# Altium schematic sheet Indicators.SchDoc: Title
size A4; Project: Q24 VCU; ENG_APP_DATE: --/--/--; DSN_APP_DATE: --/--/--; CHK_APP_DATE: --/--/--; Date: *******; ApprovedBy: *******; CheckedBy: None; Author: *******; CompanyName: *******; DrawnBy: Jacob Chisholm; Engineer: *******; Organization: *******; Address1: *******; Address2: *******; Address3: *******; Address4: *******; DocumentNumber: 12; Revision: *******; SheetNumber: 12; SheetTotal: 14; Address_Website: https://jchisholm204.github.io; E-Mail: JacobChisholm1010@gmail.com; CurrentTime: *******; CurrentDate: *******; Time: *******; DocumentFullPathAndName: *******; DocumentName: *******; ModifiedDate: *******; ImagePath: *******; ProjectName: *******; Application_BuildNumber: *******
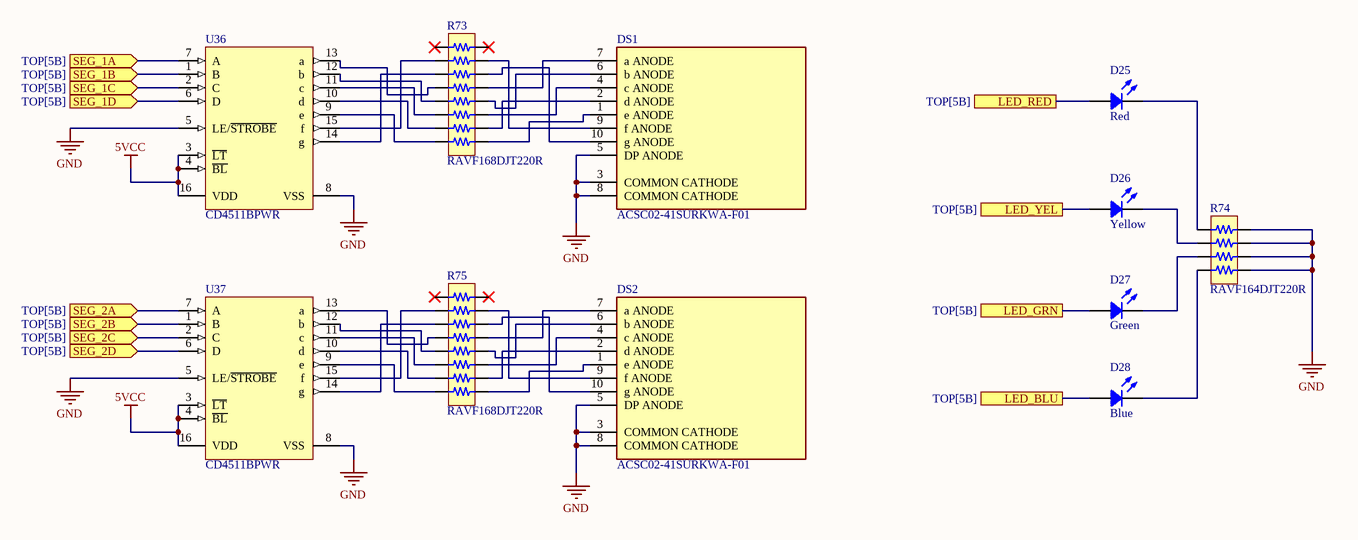
[diagram p0: Indicators.SchDoc]

## Parts
D25  Red  [LED 0805_2012 RED]
D26  Yellow  [LED 0805_2012 YELLOW]
D27  Green  [LED 0805_2012 GREEN]
D28  Blue  [LED 0805_2012 BLUE]
DS1  ACSC02-41SURKWA-F01  [FP-ACSC02-41SURKWA-F01-MFG]
DS2  ACSC02-41SURKWA-F01  [FP-ACSC02-41SURKWA-F01-MFG]
R73  RAVF168DJT220R  [RESNET 1506-16 CONVEX]
R74  RAVF164DJT220R  [RESNET 1206-8 CONVEX]
R75  RAVF168DJT220R  [RESNET 1506-16 CONVEX]
U36  CD4511BPWR  [PW0016A_N]
U37  CD4511BPWR  [PW0016A_N]

## Ports
LED_BLU (see TOP[5B]), LED_GRN (see TOP[5B]), LED_RED (see TOP[5B]), LED_YEL (see TOP[5B]), SEG_1A (in, see TOP[5B]), SEG_1B (in, see TOP[5B]), SEG_1C (in, see TOP[5B]), SEG_1D (in, see TOP[5B]), SEG_2A (in, see TOP[5B]), SEG_2B (in, see TOP[5B]), SEG_2C (in, see TOP[5B]), SEG_2D (in, see TOP[5B])

## Nets
5VCC: U36.3(~{LT}) U36.4(~{BL}) U36.16(VDD) U37.3(~{LT}) U37.4(~{BL}) U37.16(VDD)
GND: DS1.3(COMMON_CATHODE) DS1.5(DP_ANODE) DS1.8(COMMON_CATHODE) DS2.3(COMMON_CATHODE) DS2.5(DP_ANODE) DS2.8(COMMON_CATHODE) R74.5 R74.6 R74.7 R74.8 U36.5(LE/~{STROBE}) U36.8(VSS) U37.5(LE/~{STROBE}) U37.8(VSS)
LED_BLU: D28.1 ; port LED_BLU
LED_GRN: D27.1 ; port LED_GRN
LED_RED: D25.1 ; port LED_RED
LED_YEL: D26.1 ; port LED_YEL
SEG_1A: U36.7(A) ; port SEG_1A
SEG_1B: U36.1(B) ; port SEG_1B
SEG_1C: U36.2(C) ; port SEG_1C
SEG_1D: U36.6(D) ; port SEG_1D
SEG_2A: U37.7(A) ; port SEG_2A
SEG_2B: U37.1(B) ; port SEG_2B
SEG_2C: U37.2(C) ; port SEG_2C
SEG_2D: U37.6(D) ; port SEG_2D
NetD25_2: D25.2 R74.1
NetD26_2: D26.2 R74.2
NetD27_2: D27.2 R74.3
NetD28_2: D28.2 R74.4
NetDS1_1: DS1.1(e_ANODE) R73.9
NetDS1_2: DS1.2(d_ANODE) R73.10
NetDS1_4: DS1.4(c_ANODE) R73.11
NetDS1_6: DS1.6(b_ANODE) R73.12
NetDS1_7: DS1.7(a_ANODE) R73.13
NetDS1_9: DS1.9(f_ANODE) R73.15
NetDS1_10: DS1.10(g_ANODE) R73.14
NetDS2_1: DS2.1(e_ANODE) R75.9
NetDS2_2: DS2.2(d_ANODE) R75.10
NetDS2_4: DS2.4(c_ANODE) R75.11
NetDS2_6: DS2.6(b_ANODE) R75.12
NetDS2_7: DS2.7(a_ANODE) R75.13
NetDS2_9: DS2.9(f_ANODE) R75.15
NetDS2_10: DS2.10(g_ANODE) R75.14
NetR73_2: R73.2 U36.15(f)
NetR73_3: R73.3 U36.14(g)
NetR73_4: R73.4 U36.13(a)
NetR73_5: R73.5 U36.12(b)
NetR73_6: R73.6 U36.11(c)
NetR73_7: R73.7 U36.10(d)
NetR73_8: R73.8 U36.9(e)
NetR75_2: R75.2 U37.15(f)
NetR75_3: R75.3 U37.14(g)
NetR75_4: R75.4 U37.13(a)
NetR75_5: R75.5 U37.12(b)
NetR75_6: R75.6 U37.11(c)
NetR75_7: R75.7 U37.10(d)
NetR75_8: R75.8 U37.9(e)

Not connected (* = marked no-connect by the designer): R73 1* 16*; R75 1* 16*

## Notes on the sheet
- Title:
- Drawn By:
- Page Contents:
- Checked By:
- Size:
- Date:
- File:
- License:
- Email:
- A4
- Number:
- Time:
- Revision:
- Sheet
- Website:
- of

## Library data of the parts
D25 = SM0805URC: LED RED CLEAR 0805 SMD; Manufacturer: Bivar Inc.; Configuration: Standard; Current - Test: 20mA; Lens Color: Colorless; Lens Size: 1.40mm x 1.20mm; Lens Style: Rectangle with Flat Top; Millicandela Rating: 55mcd; Viewing Angle: 130°; Voltage - Forward (Vf) (Typ): 2.1V; Wavelength - Dominant: 640nm; Wavelength - Peak: 655nm; Part Number: SM0805URC; Color: Red; ComponentLink1Description: Datasheet; ComponentLink1URL: https://www.bivar.com/Files/Datasheets/SM0805URC.pdf; ComponentLink2Description: DigiKey Link; ComponentLink2URL: https://www.digikey.com/en/products/detail/bivar-inc/SM0805URC/528906; Device Package: 0805 (2012 Metric); Height (Max): 1.10mm; LastUpdated: 1/17/2024 9:33:19 PM; Lens Transparency: Clear; Lifecycle Status: Active; Minimum Order: 1; Mounting Type: Surface Mount; Package / Case: 0805 (2012 Metric); Packaging: TapeAndReel; PartId: 317; Part Status: Active; Price: 0.17; Series: -; Size / Dimension: 2.00mm L x 1.20mm W; Supplier 1: DigiKey; Supplier Part Number 1: 492-1350-1-ND; Supplier Device Package: 0805; Value: Red
D26 = SM0805UYC: LED YELLOW CLEAR 0805 SMD; Manufacturer: Bivar Inc.; Configuration: Standard; Current - Test: 20mA; Lens Color: Colorless; Lens Size: 1.40mm x 1.20mm; Lens Style: Rectangle with Flat Top; Millicandela Rating: 70mcd; Viewing Angle: 130°; Voltage - Forward (Vf) (Typ): 2.1V; Wavelength - Dominant: 592nm; Wavelength - Peak: 593nm; Part Number: SM0805UYC; Color: Yellow; ComponentLink1Description: Datasheet; ComponentLink1URL: https://www.bivar.com/Files/Datasheets/SM0805UYC.pdf; ComponentLink2Description: DigiKey Link; ComponentLink2URL: https://www.digikey.com/en/products/detail/bivar-inc/SM0805UYC/2408547; Device Package: 0805 (2012 Metric); Height (Max): 0.80mm; LastUpdated: 1/17/2024 9:34:39 PM; Lens Transparency: Clear; Lifecycle Status: Active; Minimum Order: 1; Mounting Type: Surface Mount; Package / Case: 0805 (2012 Metric); Packaging: TapeAndReel; PartId: 64; Part Status: Active; Price: 0.17; Series: -; Size / Dimension: 2.00mm L x 1.20mm W; Supplier 1: DigiKey; Supplier Part Number 1: 492-1328-1-ND; Supplier Device Package: 0805; Value: Yellow
D27 = SM0805UGC: LED GREEN CLEAR 0805 SMD; Manufacturer: Bivar Inc.; Configuration: Standard; Current - Test: 20mA; Lens Color: Colorless; Lens Size: 1.40mm x 1.20mm; Lens Style: Rectangle with Flat Top; Millicandela Rating: 10mcd; Viewing Angle: 130°; Voltage - Forward (Vf) (Typ): 2V; Wavelength - Dominant: 565nm; Wavelength - Peak: 563nm; Part Number: SM0805UGC; Color: Green; ComponentLink1Description: Datasheet; ComponentLink1URL: https://www.bivar.com/Files/Datasheets/SM0805UGC.pdf; ComponentLink2Description: DigiKey Link; ComponentLink2URL: https://www.digikey.com/en/products/detail/bivar-inc/SM0805UGC/2408549; Device Package: 0805 (2012 Metric); Height (Max): 1.10mm; LastUpdated: 1/17/2024 9:33:43 PM; Lens Transparency: Clear; Lifecycle Status: Active; Minimum Order: 1; Mounting Type: Surface Mount; Package / Case: 0805 (2012 Metric); Packaging: TapeAndReel; PartId: 247; Part Status: Active; Price: 0.19; Series: -; Size / Dimension: 2.00mm L x 1.20mm W; Supplier 1: DigiKey; Supplier Part Number 1: 492-1329-1-ND; Supplier Device Package: 0805; Value: Green
D28 = SM0805UBWC: LED BLUE CLEAR 0805 SMD; Manufacturer: Bivar Inc.; Configuration: Standard; Current - Test: 20mA; Lens Color: Colorless; Lens Size: 1.40mm x 1.20mm; Lens Style: Rectangle with Flat Top; Millicandela Rating: 115mcd; Viewing Angle: 130°; Voltage - Forward (Vf) (Typ): 3.3V; Wavelength - Dominant: 470nm; Wavelength - Peak: 468nm; Part Number: SM0805UBWC; Color: Blue; ComponentLink1Description: Datasheet; ComponentLink1URL: https://www.bivar.com/Files/Datasheets/SM0805UBWC.pdf; ComponentLink2Description: DigiKey Link; ComponentLink2URL: https://www.digikey.com/en/products/detail/bivar-inc/SM0805UBWC/2408548; Device Package: 0805 (2012 Metric); Height (Max): 1.10mm; LastUpdated: 1/17/2024 9:31:18 PM; Lens Transparency: Clear; Lifecycle Status: Active; Minimum Order: 1; Mounting Type: Surface Mount; Package / Case: 0805 (2012 Metric); Packaging: TapeAndReel; PartId: 763; Part Status: Active; Price: 0.46; Series: -; Size / Dimension: 2.00mm L x 1.20mm W; Supplier 1: DigiKey; Supplier Part Number 1: 492-1330-1-ND; Supplier Device Package: 0805; Value: Blue
DS1 DS2 = CMP-44525-000002-1: DISPLAY 7-SEG 0.2" SGL RED 10SMD; Element Configuration: Common Cathode; Operating Supply Voltage: 1.95V; Wavelength: 630nm; Power Consumption: 75mW; Number of Characters: 1; Forward Current: 30mA; Test Current: 20mA; Luminous Intensity: 30mcd; Min Operating Temperature: -40°C; Package Quantity: 650; Height: 0.315inch; Packaging: Tape and Reel; Width: 0.272inch; Max Power Dissipation: 75mW; Color: Red; Illumination Color: Red; Lead Free: Lead Free; Case/Package: SMD/SMT; Max Operating Temperature: 85°C; Forward Voltage: 1.95V
R73 R75 = RAVF168DJT220R: RES ARRAY 8 RES 220 OHM 1506; Manufacturer: Stackpole Electronics Inc; Circuit Type: Isolated; Number of Resistors: 8; Power Per Element: 62.5mW; Resistance (Ohms): 220; Temperature Coefficient: ±200ppm/°C; Tolerance: ±5%; Part Number: RAVF168DJT220R; ComponentLink1Description: Datasheet; ComponentLink1URL: https://www.seielect.com/catalog/sei-ravf.pdf; ComponentLink2Description: DigiKey Link; ComponentLink2URL: https://www.digikey.com/en/products/detail/stackpole-electronics-inc/RAVF168DJT220R/6273027; Height - Seated (Max): 0.020" (0.50mm); LastUpdated: 2/1/2024 9:38:25 PM; Lifecycle Status: Active; Minimum Order: 1; Mounting Type: Surface Mount; Number of Pins: 16; Operating Temperature: -55°C ~ 155°C; Package / Case: 1506, Convex, Long Side Terminals; Packaging: TapeAndReel; PartId: 654; Part Status: Active; Price: 0.03; Series: RAVF; Size / Dimension: 0.157" L x 0.063" W (4.00mm x 1.60mm); Supplier 1: DigiKey; Supplier Part Number 1: 738-RAVF168DJT220RCT-ND
R74 = RAVF164DJT220R: RES ARRAY 4 RES 220 OHM 1206; Manufacturer: Stackpole Electronics Inc; Circuit Type: Isolated; Number of Resistors: 4; Power Per Element: 62.5mW; Resistance (Ohms): 220; Temperature Coefficient: ±200ppm/°C; Tolerance: ±5%; Part Number: RAVF164DJT220R; Applications: Automotive AEC-Q200; ComponentLink1Description: Datasheet; ComponentLink1URL: https://www.seielect.com/catalog/sei-ravf.pdf; ComponentLink2Description: DigiKey Link; ComponentLink2URL: http://digikey.com/product-detail/en/stackpole-electronics-inc/RAVF164DJT220R/RAVF164DJT220RCT-ND/2425248; Height - Seated (Max): 0.024" (0.60mm); LastUpdated: 9/2/2020 1:23:25 AM; Lifecycle Status: Active; Minimum Order: 1; Mounting Type: Surface Mount; Number of Pins: 8; Operating Temperature: -55°C ~ 155°C; Package / Case: 1206 (3216 Metric), Convex, Long Side Terminals; Packaging: TapeAndReel; PartId: 59; Part Status: Active; Price: 0.01; Series: RAVF; Size / Dimension: 0.126" L x 0.063" W (3.20mm x 1.60mm); Supplier 1: DigiKey; Supplier Part Number 1: RAVF164DJT220RCT-ND
U36 U37 = CMP-0388-00393-2: CMOS BCD-to-7-Segment LED Latch / Decoder / Driver, 3 to 18 V, -55 to 125 degC, 16-pin SOP (PW16), Green (RoHS & no Sb/Br); Manufacturer: Texas Instruments; SubFamily: Discrete Segment LED Driver; Vin(Max)(V): 18; Rating: Military; Vin(Min)(V): 3; ComponentLink2Description: Datasheet; DatasheetVersion: SCHS072B; ComponentLink3Description: Package Specification; PackageReference: PW0016A; ComponentLink2URL: http://www.ti.com/general/docs/lit/getliterature.tsp?genericPartNumber=CD4511B&fileType=pdf; PackageVersion: 4040064-4/G; ComponentLink3URL: http://www.ti.com/lit/ml/mpds361/mpds361.pdf; Eco-Plan: Green (RoHS & no Sb/Br); ComponentLink1Description: Manufacturer URL; Code_JEDEC: MO-153; ComponentLink1URL: http://www.ti.com/; PartNumber: CD4511BPWR; Mounting Technology: Surface Mount; PackageDescription: 16-Pin Plastic Small Outline, Body 4.40 x 5.00 mm, Pitch 0.65 mm